# EAGLE schematic Custom Board 2 Final (EAGLE 6.5.0)
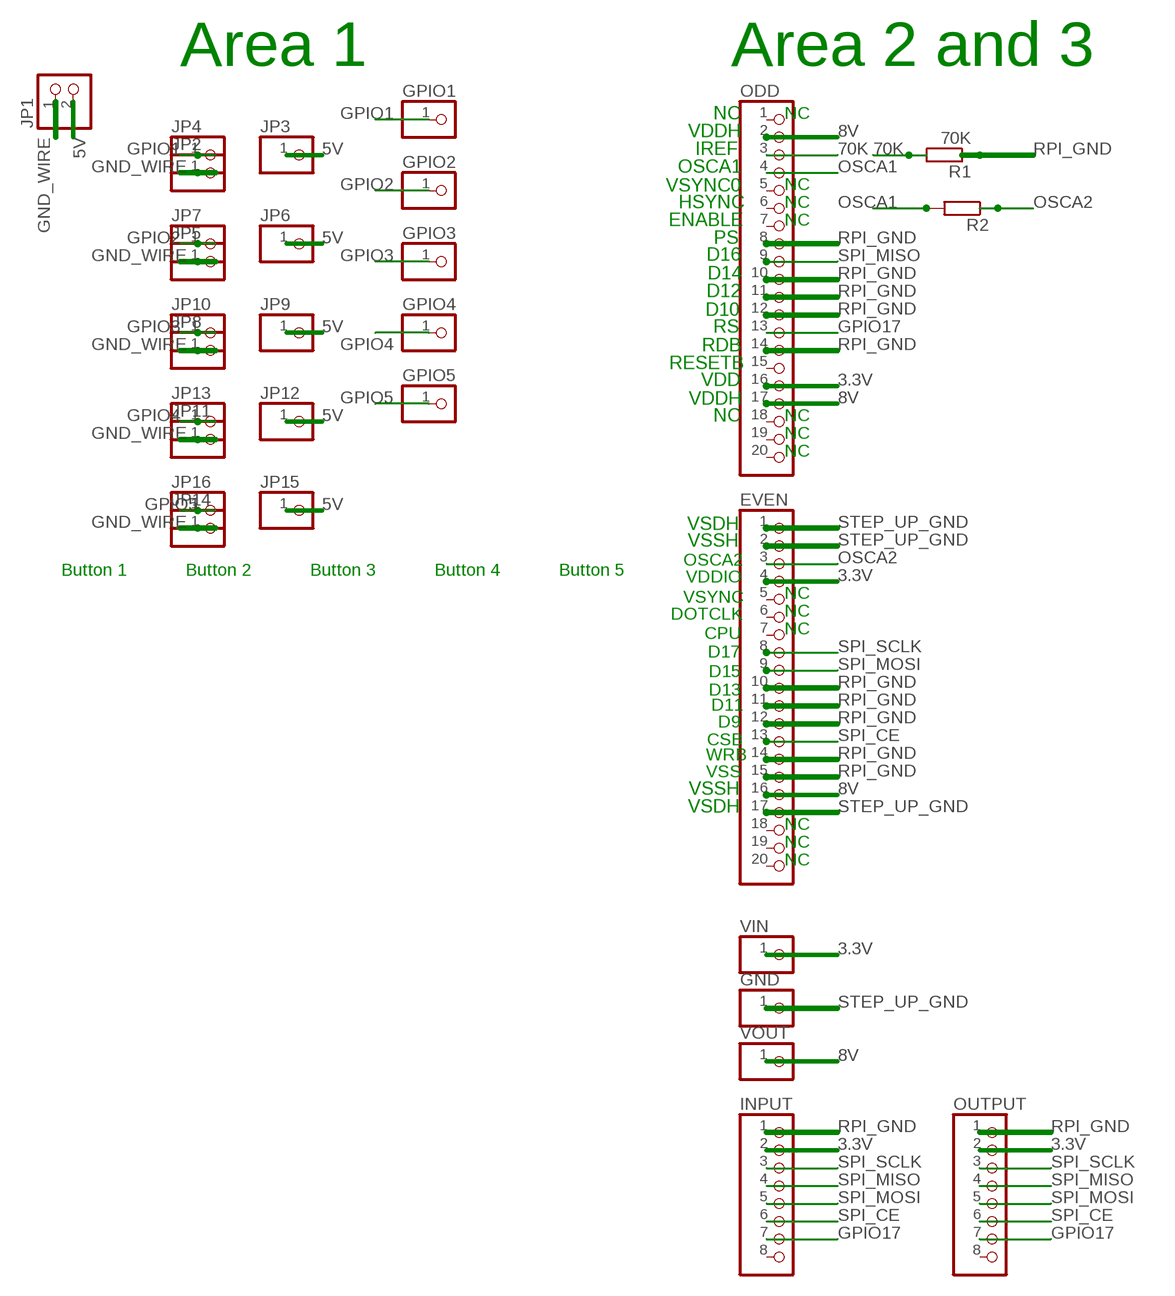
[diagram p0: schematic, sheet 1]

## Parts
EVEN  PINHD-1X20  [1X20]
GND  PINHD-1X1  [1X01]
GPIO1  PINHD-1X1  [1X01]
GPIO2  PINHD-1X1  [1X01]
GPIO3  PINHD-1X1  [1X01]
GPIO4  PINHD-1X1  [1X01]
GPIO5  PINHD-1X1  [1X01]
INPUT  PINHD-1X8  [1X08]
JP1  PINHD-1X2  [1X02]
JP2  PINHD-1X1  [1X01]
JP3  PINHD-1X1  [1X01]
JP4  PINHD-1X1  [1X01]
JP5  PINHD-1X1  [1X01]
JP6  PINHD-1X1  [1X01]
JP7  PINHD-1X1  [1X01]
JP8  PINHD-1X1  [1X01]
JP9  PINHD-1X1  [1X01]
JP10  PINHD-1X1  [1X01]
JP11  PINHD-1X1  [1X01]
JP12  PINHD-1X1  [1X01]
JP13  PINHD-1X1  [1X01]
JP14  PINHD-1X1  [1X01]
JP15  PINHD-1X1  [1X01]
JP16  PINHD-1X1  [1X01]
ODD  PINHD-1X20  [1X20]
OUTPUT  PINHD-1X8  [1X08]
R1  70K  R-EU_0204/7  [0204/7]
R2  R-EU_0204/7  [0204/7]
VIN  PINHD-1X1  [1X01]
VOUT  PINHD-1X1  [1X01]

## Nets
3.3V [POWER]: EVEN.4 INPUT.2 ODD.16 OUTPUT.2 VIN.1
5V [POWER]: JP1.2 JP3.1 JP6.1 JP9.1 JP12.1 JP15.1
8V [POWER]: EVEN.16 ODD.2 ODD.17 VOUT.1
70K: ODD.3 R1.2
GND_WIRE [GND]: JP1.1 JP2.1 JP5.1 JP8.1 JP11.1 JP14.1
GPIO1: GPIO1.1 JP4.1
GPIO2: GPIO2.1 JP7.1
GPIO3: GPIO3.1 JP10.1
GPIO4: GPIO4.1 JP13.1
GPIO5: GPIO5.1 JP16.1
GPIO17: INPUT.7 ODD.13 OUTPUT.7
OSCA1: ODD.4 R2.2
OSCA2: EVEN.3 R2.1
RPI_GND [GND]: EVEN.10 EVEN.11 EVEN.12 EVEN.14 EVEN.15 INPUT.1 ODD.8 ODD.10 ODD.11 ODD.12 ODD.14 OUTPUT.1 R1.1
SPI_CE: EVEN.13 INPUT.6 OUTPUT.6
SPI_MISO: INPUT.4 ODD.9 OUTPUT.4
SPI_MOSI: EVEN.9 INPUT.5 OUTPUT.5
SPI_SCLK: EVEN.8 INPUT.3 OUTPUT.3
STEP_UP_GND [GND]: EVEN.1 EVEN.2 EVEN.17 GND.1
Unconnected: EVEN.5 EVEN.6 EVEN.7 EVEN.18 EVEN.19 EVEN.20 INPUT.8 ODD.1 ODD.5 ODD.6 ODD.7 ODD.15 ODD.18 ODD.19 ODD.20 OUTPUT.8

## Notes on the sheet
- Area 1 | Area 2 and 3
- NC | NC
- VDDH
- IREF
- OSCA1
- VSYNC0 | NC
- HSYNC | NC
- ENABLE | NC
- PS
- D16
- D14
- D12
- D10
- RS
- RDB
- RESETB
- VDD
- VDDH
- NC | NC
- NC
- NC
- VSDH
- VSSH
- Button 1 | Button 2 | Button 3 | Button 4 | Button 5 | OSCA2
- VDDIO
- VSYNC | NC
- DOTCLK | NC
- CPU | NC
- D17
- D15
- D13
- D11
- D9
- CSB
- WRB
- VSS
- VSSH
- VSDH
- NC
- NC
- NC

## Library data of the parts
EVEN ODD = pinhead:PINHD-1X20: PIN HEADER
GND GPIO1-GPIO5 JP2-JP16 VIN VOUT = pinhead:PINHD-1X1: PIN HEADER
INPUT OUTPUT = pinhead:PINHD-1X8: PIN HEADER
JP1 = pinhead:PINHD-1X2: PIN HEADER
R1 R2 = resistor:R-EU_: RESISTOR, European symbol

## Net classes
1 GND: width 0.813 mm
2 POWER: width 0.61 mm